# Altium schematic sheet Serial.SchDoc
size 420 x 297 mm; SheetNumber: 7; SheetTotal: 11
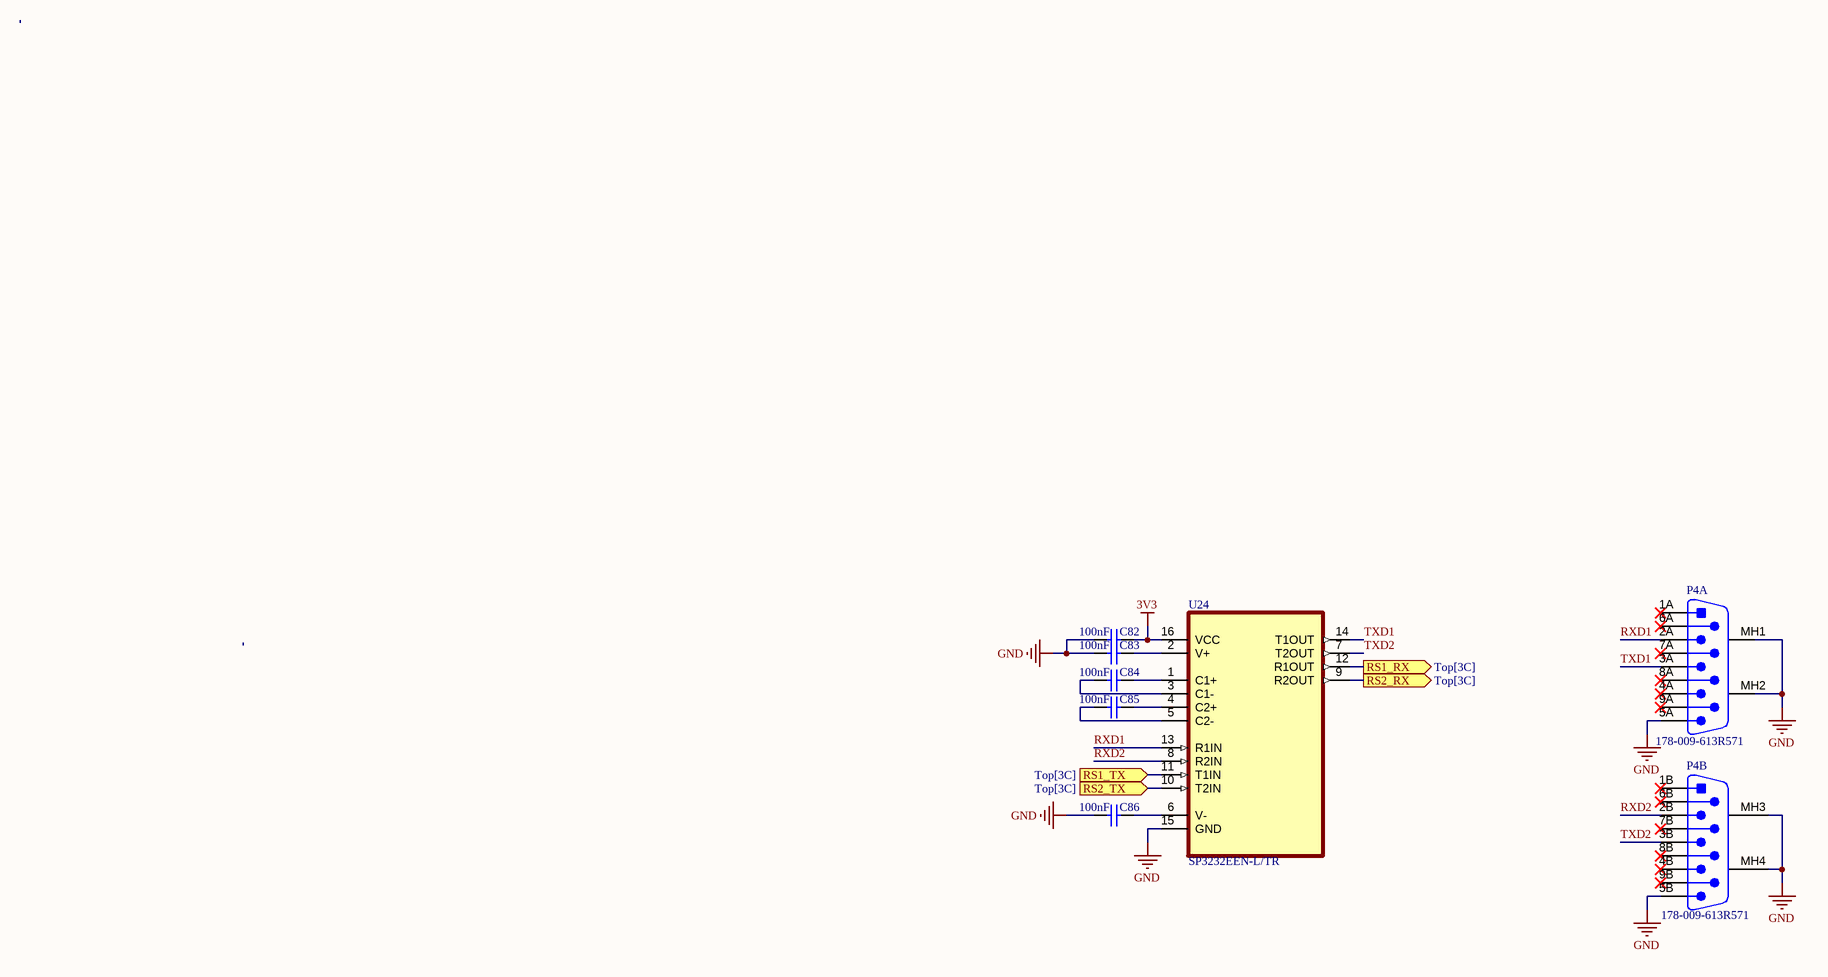
[diagram p0: Serial.SchDoc]

## Parts
C82  value 100nF  (hidden comment: Capacitor)
C83  value 100nF  (hidden comment: Capacitor)
C84  value 100nF  (hidden comment: Capacitor)
C85  value 100nF  (hidden comment: Capacitor)
C86  value 100nF  (hidden comment: Capacitor)
P4  178-009-613R571  [NORCO-178-009-613R571_V]  (parts A,B of 2)
U24  SP3232EEN-L/TR  [SOIC127P600X175-16N]

## Ports
RS1_RX (out, see Top[3C]), RS1_TX (in, see Top[3C]), RS2_RX (out, see Top[3C]), RS2_TX (in, see Top[3C])

## Nets
3V3: C82.1 U24.16(VCC)
GND: C82.2 C83.2 C86.2 P4.5A(4A) P4.5B P4.MH1 P4.MH2 P4.MH3 P4.MH4 U24.15(GND)
RS1_RX: U24.12(R1OUT) ; port RS1_RX
RS1_TX: U24.11(T1IN) ; port RS1_TX
RS2_RX: U24.9(R2OUT) ; port RS2_RX
RS2_TX: U24.10(T2IN) ; port RS2_TX
RXD1: P4.2A U24.13(R1IN)
RXD2: P4.2B U24.8(R2IN)
TXD1: P4.3A(6A) U24.14(T1OUT)
TXD2: P4.3B U24.7(T2OUT)
NetC83_1: C83.1 U24.2(V+)
NetC84_1: C84.1 U24.1(C1+)
NetC84_2: C84.2 U24.3(C1-)
NetC85_1: C85.1 U24.4(C2+)
NetC85_2: C85.2 U24.5(C2-)
NetC86_1: C86.1 U24.6(V-)

Not connected (* = marked no-connect by the designer): P4 1A* 1B* 4A(5A)* 4B* 6A(3A)* 6B* 7A* 7B* 8A* 8B* 9A* 9B*

## Notes on the sheet
- THIS DOCUMENT AND THE DATA DISCLOSED HEREIN OR
- HEREWITH IS THE PROPERTY OF ALTIUM LIMITED AND MAY
- DWG NO:
- REVISION
- REV:
- DESCRIPTION
- DATE
- APPROVED
- BE FREELY DISTRIBUTED IN WHOLE. NO RIGHTS ARE
- RESERVED OR EXPRESS OR IMPLIED WARANTEE GIVEN.
- ENG:
- APPROVALS
- PROJECT
- DSN:
- CHK:
- REFERENCE DOCUMENTS
- PROJECT REVISION:
- TITLE
- DOCUMENT REVISION:
- DESIGN ITEM:
- BOM:
- FAB DWG:
- PCB DWG:
- ASSY DWG:
- SCALE:
- A3
- SIZE
- CAGE CODE
- FILE NAME
- DWG NO.
- SHEET
- OF
- REV

## Library data of the parts
C82-C86 = Capacitor: SimulationGenericComponent: True; Supplier 1: Arrow Electronics
P4 = CMP-2000-05502-1: D-Sub Connector, Stacked Plug, RA, -55 to 105 degC, 18-Pin THD, RoHS, Tray; Manufacturer: Norcomp; Product Training Modules: D-SubConnectors; 3D Model: 178-009-613Rzz1.pdf178-009-613Rzz1.stp178-009-613Rzz1.igs; Number of Positions: 9,9; Catalog Drawings: 178,179,189SeriesFront; Flange Feature: MatingSide,FemaleScrewlock(4-40); Connector Style: D-Sub-Stacked; Connector Type: Plug,MalePins; Associated Product: 160-09MA-ND-DUSTCOVERFORDB9MALE; Other Related Documents: 178-009-613R571MaterialDeclaration; Current Rating: 5A; Other Names: 1109MME178009613R571; Online Catalog: 178Series; Family: D-SubConnectors; Ingress Protection: -; Package Reference: 178-009-613R571; Features: BoardLock,GroundingIndents,Shielded; Packaging: Tray; Voltage Rating: -; Standard Package: 45; Number of Rows: 2,2; Termination: Solder; Contact Type: Signal; Series: 178; Operating Temperature: -55°C~105°C; Contact Finish: Gold; Color: Black; Shell Material, Finish: Steel,NickelPlated; Category: Connectors,Interconnects; Datasheet URL: http://www.norcomp.net/rohspdfs/Connectors/17Y/178/613/178-YYY-613R571.pdf; Mounting Type: BoardEdge,ThroughHole,RightAngle; Datasheet Version: Rev. 6, 03/2007; Manufacturer URL: http://www.norcomp.net/; Contact Finish Thickness: Flash; Package Description: 18-Pin Through Hole Device, Body 30.58 x 19.61 mm; Housing Material: Polyamide(PA9T),Nylon9T; Shell Size, Connector Layout: 1(DE,E);1(DE,E); Mounting Technology: ThroughHole
U24 = CMP-017-000000-1: 2/2 Transceiver Full RS232 16-SOIC; MF: MaxLinear, Inc.; Design Item ID: SP3232EEN-L/TR; Price: None; Component Type: Standard; Availability: Unavailable; Source: SnapEDAsch.SchLib; MP: SP3232EEN-L/TR; Value: *; Pin Count: 16; SnapEDA_Link: https://www.snapeda.com/parts/SP3232EEN-L/TR/MaxLinear,%20Inc./view-part/552440/?ref=snap; Package: SOIC-16 Exar